# Altium schematic sheet PCB0814.SchDoc
size A3
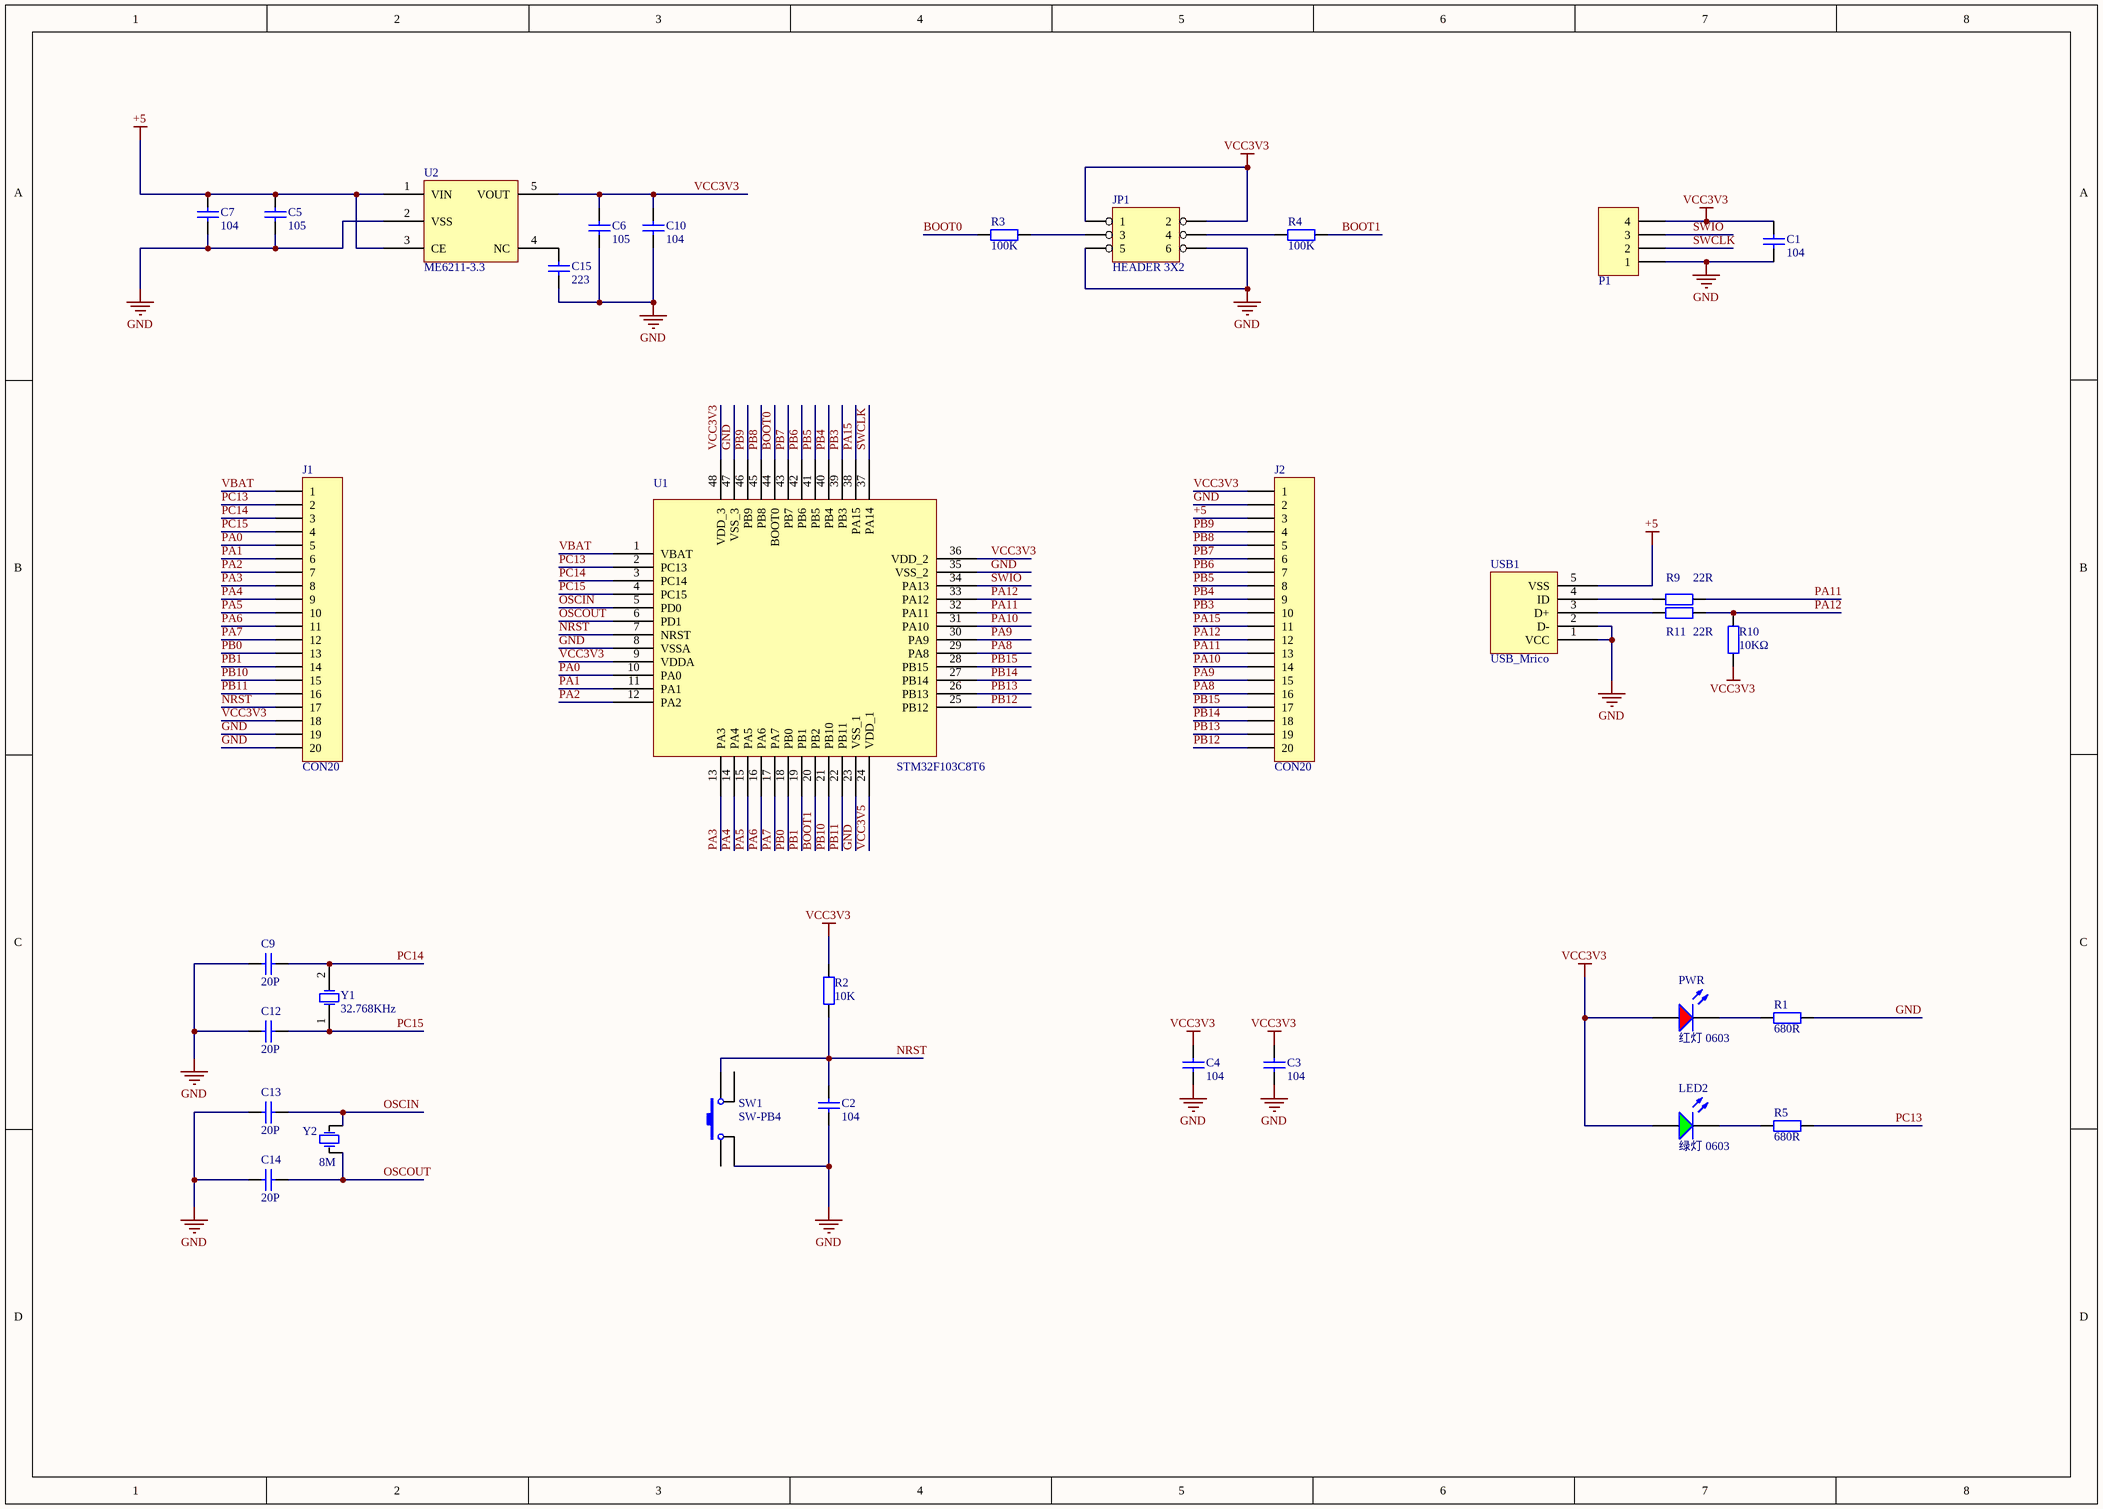
[diagram p0: PCB0814.SchDoc]

## Parts
C1  104  [0603_C]
C2  104  [0603_C]
C3  104  [0603_C]
C4  104  [0603_C]
C5  105  [0603_C]
C6  105  [0603_C]
C7  104  [0603_C]
C9  20P  [0603_C]
C10  104  [0603_C]
C12  20P  [0603_C]
C13  20P  [0603_C]
C14  20P  [0603_C]
C15  223  [0603_C]
J1  CON20  [HDR1X20]
J2  CON20  [HDR1X20]
JP1  HEADER 3X2  [HDR2X3]
LED2  绿灯 0603  [0603_LED_S1]
P1  Header 4  [HDR4X1_A]  (value not drawn)
PWR  红灯 0603  [0603_LED_S1]
R1  680R  [0603_R]
R2  10K  [0603_R]
R3  100K  [0603_R]
R4  100K  [0603_R]
R5  680R  [0603_R]
R9  22R  [0603_R]
R10  10KΩ  [0603_R]
R11  22R  [0603_R]
SW1  SW-PB4  [SW_PB4_A1]
U1  STM32F103C8T6  [LQFP-48]
U2  ME6211-3.3  [SOT-23-5]
USB1  USB_Mrico  [USB_MICRO]
Y1  32.768KHz  [SMD-5032_2P]
Y2  value 8M  [X-SM49]  (hidden comment: XTAL)

## Nets
+5: C5.2 C7.2 J2.3 U2.1(VIN) U2.3(CE) USB1.5(VSS)
GND: C1.2 C2.1 C3.2 C4.2 C5.1 C6.1 C7.1 C9.1 C10.1 C12.1 C13.1 C14.1 C15.1 J1.19 J1.20 J2.2 JP1.5 JP1.6 P1.1 R1.2 SW1.4 U1.8(VSSA) U1.23(VSS_1) U1.35(VSS_2) U1.47(VSS_3) U2.2(VSS) USB1.1(VCC) USB1.2(D-)
VCC3V3: C1.1 C3.1 C4.1 C6.2 C10.2 J1.18 J2.1 JP1.1 JP1.2 LED2.A P1.4 PWR.A R2.2 R10.1 U1.9(VDDA) U1.36(VDD_2) U1.48(VDD_3) U2.5(VOUT)
BOOT0: R3.1 U1.44(BOOT0)
BOOT1: R4.2 U1.20(PB2)
NRST: C2.2 J1.17 R2.1 SW1.2 U1.7(NRST)
OSCIN: C13.2 U1.5(PD0) Y2.2(OSC2)
OSCOUT: C14.2 U1.6(PD1) Y2.1(OSC1)
PA0: J1.5 U1.10(PA0)
PA1: J1.6 U1.11(PA1)
PA2: J1.7 U1.12(PA2)
PA3: J1.8 U1.13(PA3)
PA4: J1.9 U1.14(PA4)
PA5: J1.10 U1.15(PA5)
PA6: J1.11 U1.16(PA6)
PA7: J1.12 U1.17(PA7)
PA8: J2.16 U1.29(PA8)
PA9: J2.15 U1.30(PA9)
PA10: J2.14 U1.31(PA10)
PA11: J2.13 R9.2 U1.32(PA11)
PA12: J2.12 R10.2 R11.2 U1.33(PA12)
PA15: J2.11 U1.38(PA15)
PB0: J1.13 U1.18(PB0)
PB1: J1.14 U1.19(PB1)
PB3: J2.10 U1.39(PB3)
PB4: J2.9 U1.40(PB4)
PB5: J2.8 U1.41(PB5)
PB6: J2.7 U1.42(PB6)
PB7: J2.6 U1.43(PB7)
PB8: J2.5 U1.45(PB8)
PB9: J2.4 U1.46(PB9)
PB10: J1.15 U1.21(PB10)
PB11: J1.16 U1.22(PB11)
PB12: J2.20 U1.25(PB12)
PB13: J2.19 U1.26(PB13)
PB14: J2.18 U1.27(PB14)
PB15: J2.17 U1.28(PB15)
PC13: J1.2 R5.2 U1.2(PC13)
PC14: C9.2 J1.3 U1.3(PC14) Y1.2(OSC2)
PC15: C12.2 J1.4 U1.4(PC15) Y1.1(OSC1)
SWCLK: P1.2 U1.37(PA14)
SWIO: P1.3 U1.34(PA13)
VBAT: J1.1 U1.1(VBAT)
VCC3V5: U1.24(VDD_1)
NetC15_2: C15.2 U2.4(NC)
NetJP1_3: JP1.3 R3.2
NetJP1_4: JP1.4 R4.1
NetLED2_K: LED2.K R5.1
NetPWR_K: PWR.K R1.1
NetR9_1: R9.1 USB1.4(ID)
NetR11_1: R11.1 USB1.3(D+)

Not connected (* = marked no-connect by the designer): SW1 1 3

## Library data of the parts
C1 C2 C5-C7 C10 C15 = 0603 1uF (105) 10% 50V: 贴片电容; ComponentLink1Description: 供应商链接; ComponentLink1URL: http://www.szlcsc.com/product/details_16531.html; Package: 0603; Supplier: LC; SuppliersPartNumber: C15849
C3 C4 C9 C12-C14 = 0603 68pF (680) 5% 50V: 贴片电容; ComponentLink1Description: 供应商链接; ComponentLink1URL: http://www.szlcsc.com/product/details_29012.html; Package: 0603; Supplier: LC; SuppliersPartNumber: C28262
J1 J2 = CON20: Connector
LED2 = 0603 绿灯: 发光二极管; ComponentLink1Description: 供应商链接; ComponentLink1URL: http://www.szlcsc.com/product/details_73152.html; Package: 0603; Supplier: LC; SuppliersPartNumber: C72043
P1 = Header 4: 接插件; LatestRevisionDate: 17-Jul-2002; LatestRevisionNote: Re-released for DXP Platform.; Publisher: Altium Limited
PWR = 0603 红灯: 发光二极管; ComponentLink1Description: 供应商链接; ComponentLink1URL: http://www.szlcsc.com/product/details_2659.html; Package: 0603; Supplier: LC; SuppliersPartNumber: C2286
R1-R5 = 0603 1KΩ (1001) 1%: 贴片电阻; ComponentLink1Description: 供应商链接; ComponentLink1URL: http://www.szlcsc.com/product/details_21904.html; Package: 0603; Supplier: LC; SuppliersPartNumber: C21190
R9 R11 = 0603 22Ω (22R0) 1%: 贴片电阻; ComponentLink1Description: 供应商链接; ComponentLink1URL: http://www.szlcsc.com/product/details_24078.html; Package: 0603; Supplier: LC; SuppliersPartNumber: C23345
R10 = 0603 2KΩ (2001) 1%: 贴片电阻; ComponentLink1Description: 供应商链接; ComponentLink1URL: http://www.szlcsc.com/product/details_23702.html; Package: 0603; Supplier: LC; SuppliersPartNumber: C22975
SW1 = SW-PB4: 微动开关; Published: 24-Mar-1999; LatestRevisionDate: 17-Jul-2002; LatestRevisionNote: Re-released for DXP Platform.; PackageReference: SPST-2; Publisher: Altium Limited
USB1 = USB_M: MicroUSB接口
Y1 = SMD-5032_2P 11.0592MHZ 20PF 20PPM: 贴片晶振; ComponentLink1Description: 供应商链接; ComponentLink1URL: http://www.szlcsc.com/product/details_53039.html; Package: SMD-5032_2P; Supplier: LC; SuppliersPartNumber: C52026
Y2 = XTAL: 晶振; Published: 8-Jun-2000; LatestRevisionDate: 17-Jul-2002; LatestRevisionNote: Re-released for DXP Platform.; PackageReference: R38; Publisher: Altium Limited